# EAGLE design eCog109_ISP_Programmer (EAGLE 6.6.0)
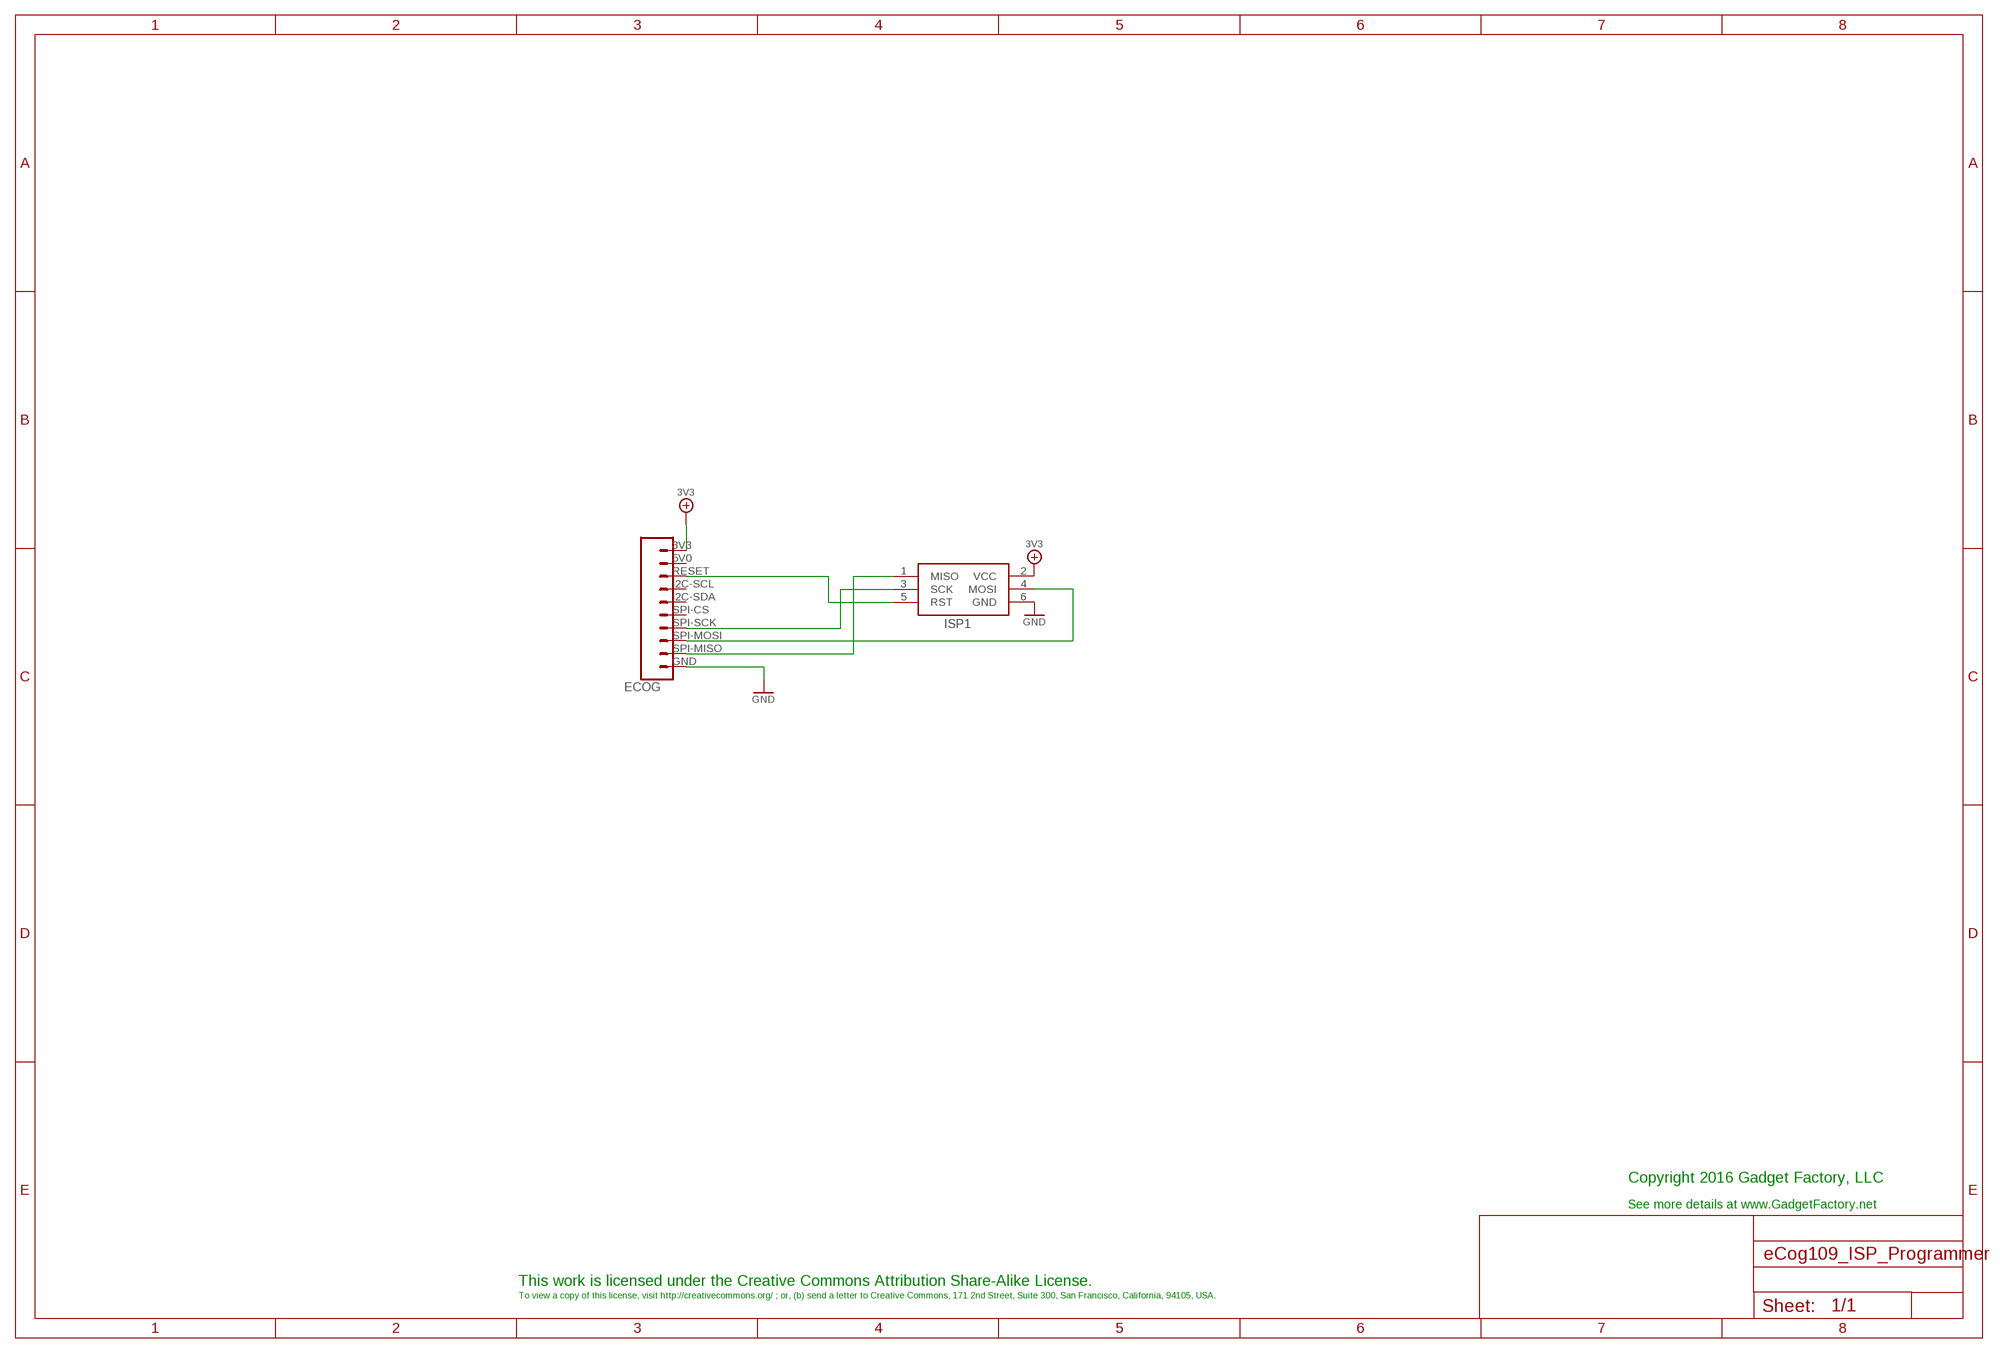
[diagram p0: schematic, sheet 1]

## Parts
ECOG  ECOG_BUSES_ROWTHROUGHHOLE  [ECOG_BUSES_TH]
ISP1  AVRISP-6  [AVRISP]

## Nets
3V3: ECOG.3V3 ISP1.2(VCC)
GND: ECOG.GND ISP1.6(GND)
N$1: ECOG.SPI-MISO ISP1.1(MISO)
N$2: ECOG.SPI-SCK ISP1.3(SCK)
N$3: ECOG.RESET(RSV) ISP1.5(RST)
N$4: ECOG.SPI-MOSI ISP1.4(MOSI)
Unconnected: ECOG.5V0(RSV) ECOG.I2C-SCL ECOG.I2C-SDA ECOG.SPI-CS

## Notes on the sheet
- Copyright 2016 Gadget Factory, LLC
- See more details at www.GadgetFactory.net
- This work is licensed under the Creative Commons Attribution Share-Alike License.
- To view a copy of this license, visit http://creativecommons.org/ ; or, (b) send a letter to Creative Commons, 171 2nd Street, Suite 300, San Francisco, California, 94105, USA.

## Library data of the parts
ECOG = eCogs:ECOG_BUSES_ROW
ISP1 = adafruit:AVRISP: AVR ISP HEADER Standard 6 pin header for AVR programming

## Board
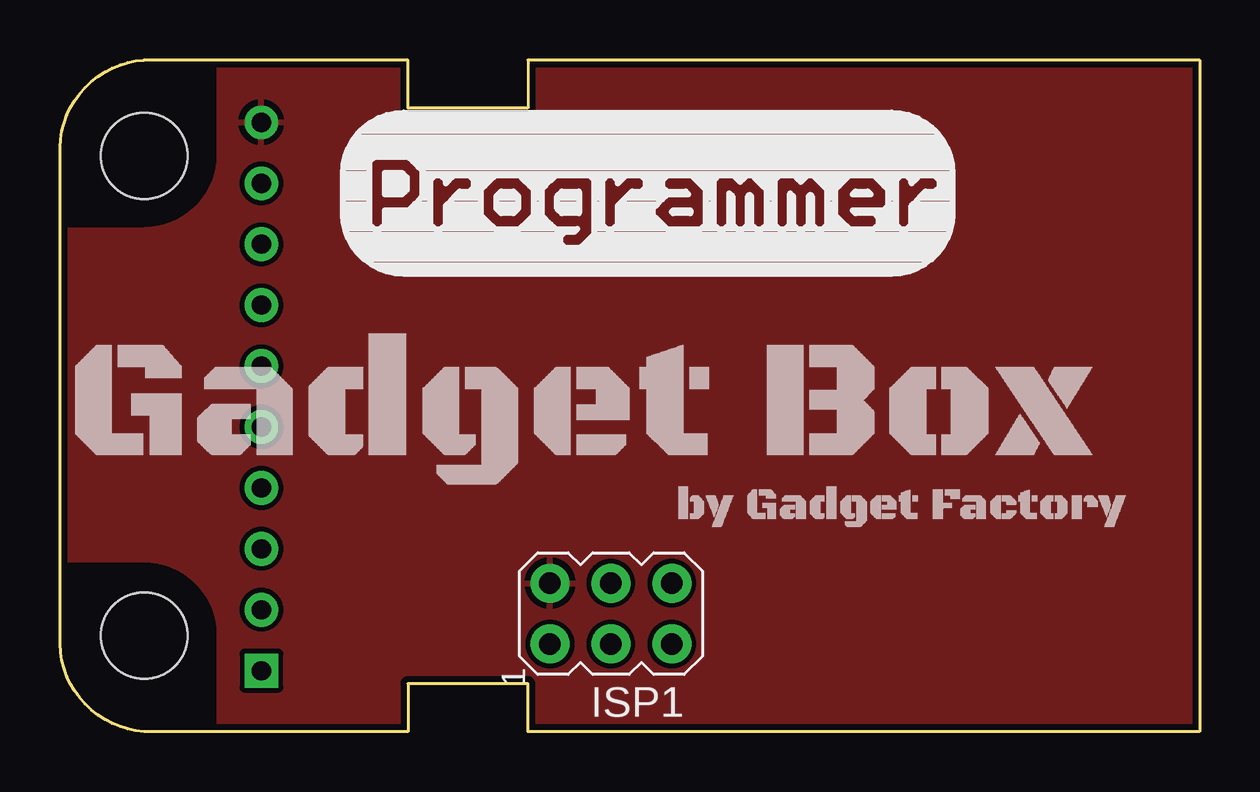
[diagram p1: board, top side]
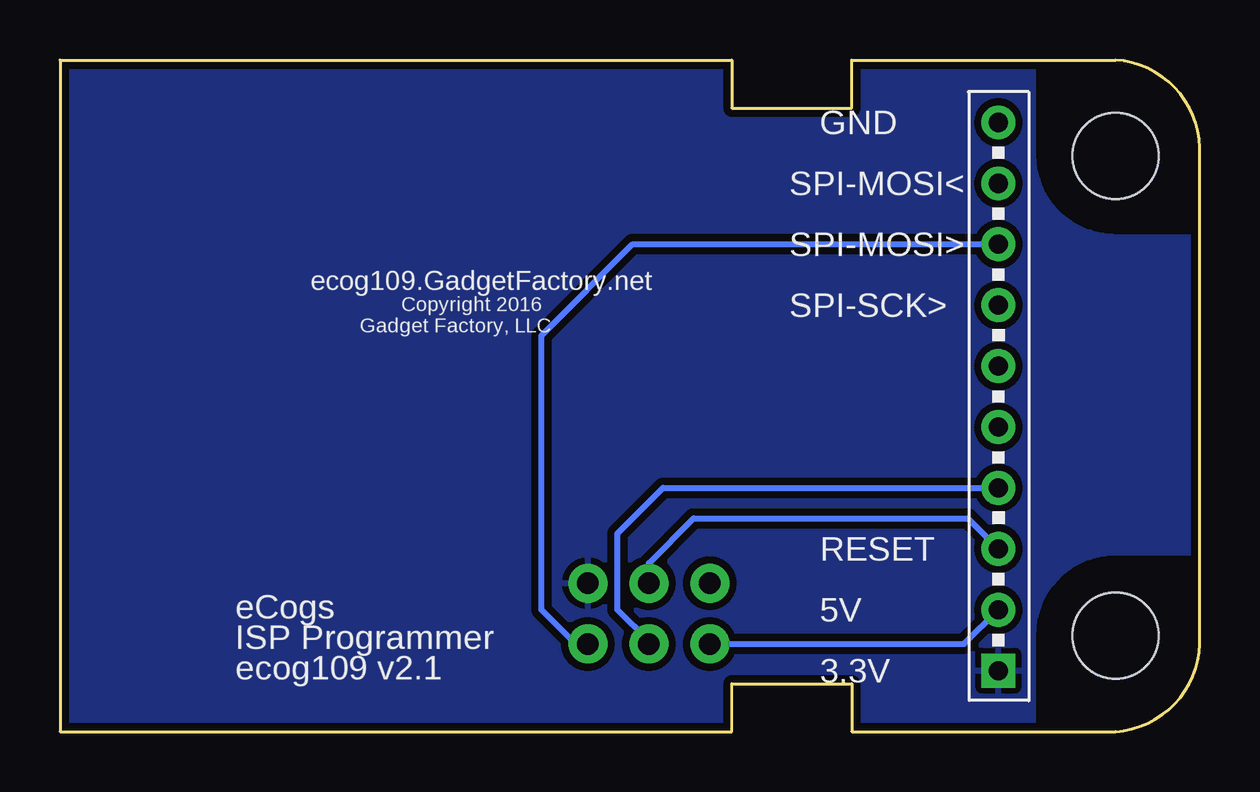
[diagram p2: board, bottom side, seen from below]

Size 47.51 x 28 mm. Coordinates in mm from the lower left corner, seen from the top.
Copper layers (1*16): Top 0.035mm / dielectric 1.5mm / Bottom 0.035mm
Design rules "SparkFun": minimum track width 8mil, minimum drill 20mil, track to track 8mil, track to pad 8mil, pad to pad 8mil, via to via 8mil, smd to smd 8mil, copper to edge 10mil, drill to drill 8mil, minimum pad ring 12mil, minimum via ring 10mil, stop-mask expansion 4mil, vias tented up to drill 25mil, thermal gap 10mil

### Footprints (pad centres in the part's own frame; a part is rotated, then mirrored left to right if it is on the bottom)
ECOG_BUSES_TH = drill 0.8: 3V3 8.89,25.4; 5V0 8.89,22.86; I2C-SCL 8.89,17.78; I2C-SDA 8.89,15.24; RESET 8.89,20.32; SPI-CS 8.89,12.7; SPI-MISO 8.89,5.08; SPI-MOSI 8.89,7.62; SPI-SCK 8.89,10.16 | drill 0.8 square: GND 8.89,2.54 | hole 3.6: 4.004,24.003; 4.004,4.003
AVRISP = drill 0.9 pad 1.626: 1 -1.27,2.54; 2 1.27,2.54; 3 -1.27,0; 4 1.27,0; 5 -1.27,-2.54; 6 1.27,-2.54

### Placement (x,y rotation side)
ECOG  -0.5,0 0 top
ISP1  22.96,4.92 90 top
U$1  [GADGETBOX_TEXT]  21.9,13.24 0 top

### Tracks (layer width: path | path; a pad name or v marks a point on that pad's centre or on a via)
3V3
  pour Top: -1.5,29 48.5,29 48.5,-1 -1.5,-1
GND
  pour Bottom (isolate 0.305): -2.5,30 49.5,30 49.5,-2 -2.5,-2
N$1
  Bottom 0.254: ISP1.1 9.82,3.65 ECOG.SPI-MISO
N$2
  Bottom 0.254: ISP1.3 22.96,3.77 24.27,5.08 24.27,8.26 22.36,10.16 ECOG.SPI-SCK
N$3
  Bottom 0.254: ISP1.5 26.01,3.65 27.44,5.08 27.44,16.51 23.63,20.32 ECOG.RESET
N$4
  Bottom 0.254: ISP1.4 22.96,7.02 21.09,8.89 9.66,8.89 ECOG.SPI-MOSI

### Text on the board
bPlace: GND | SPI-MOSI< | SPI-MOSI> | Copyright 2016 | ecog109.GadgetFactory.net | SPI-SCK> | Gadget Factory, LLC | RESET | 5V | eCogs | ISP Programmer | 3.3V | ecog109 v2.1